# Altium project MB1189.PrjPCB (part 2 of 2)

## Sheet ST_LINK_V2-1.SCHDOC: ST-LINK/V2-1
size A4; Date: 9/24/2014; Author: P.A.; CompanyName: STMicroelectronics; Organization: Microcontrollers Division; Address1: 12, Rue Jules HOROWITZ; Address2: 38019 Grenoble; Address3: FRANCE; DocumentNumber: MB1189; Revision: B-07; SheetNumber: 12; SheetTotal: 12; Project: STM32F469I-DISCO
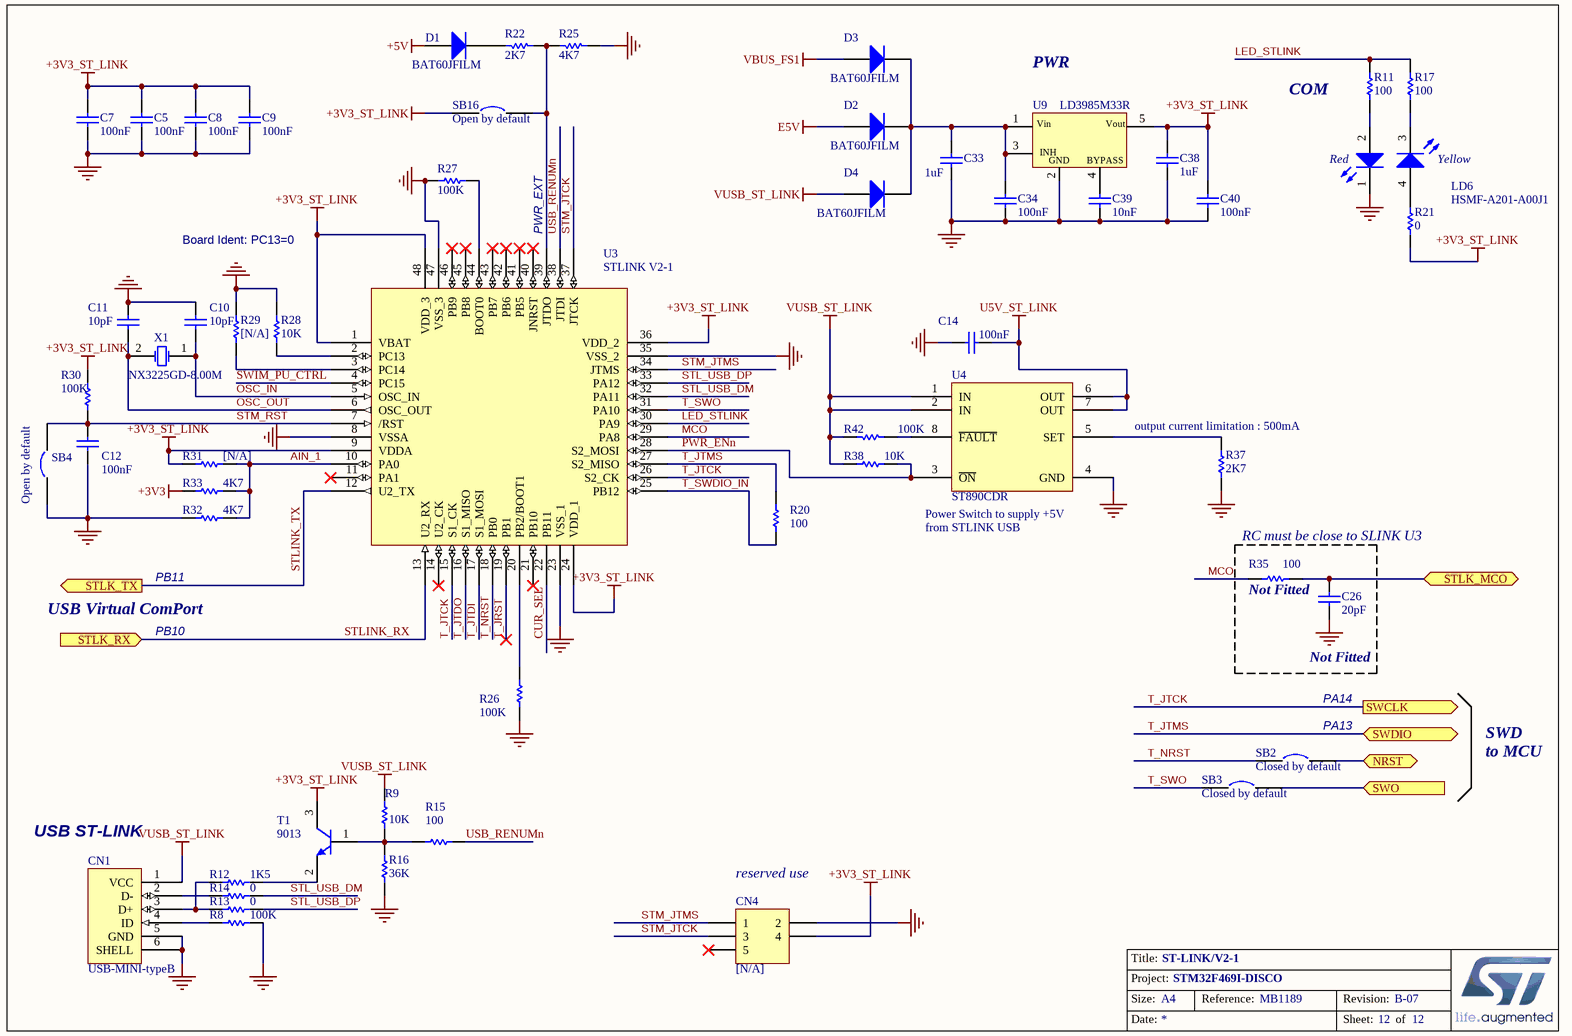
[diagram p10: ST_LINK_V2-1.SCHDOC]

### Parts
C5  100nF  [0402C]
C7  100nF  [0402C]
C8  100nF  [0402C]
C9  100nF  [0402C]
C10  10pF  [0603C]
C11  10pF  [0603C]
C12  100nF  [0402C]
C14  100nF  [0402C]
C26  20pF  [0603C]
C33  1uF  [0603C]
C34  100nF  [0402C]
C38  1uF  [0603C]
C39  10nF  [0603C]
C40  100nF  [0402C]
CN1  USB-MINI-typeB  [MINIUSB_AB_5SM_RA]
CN4  [N/A]  [HDR_2X3-1_2R54-6]
D1  BAT60JFILM  [SOD-323]
D2  BAT60JFILM  [SOD-323]
D3  BAT60JFILM  [SOD-323]
D4  BAT60JFILM  [SOD-323]
LD6  HSMF-A201-A00J1  [LED2_3528]
R8  100K  [0603R]
R9  10K  [0402R]
R11  100  [0603R]
R12  1K5  [0603R]
R13  0  [0603R]
R14  0  [0603R]
R15  100  [0603R]
R16  36K  [0603R]
R17  100  [0603R]
R20  100  [0603R]
R21  0  [0603R]
R22  2K7  [0603R]
R25  4K7  [0603R]
R26  100K  [0603R]
R27  100K  [0603R]
R28  10K  [0402R]
R29  [N/A]  [0603R]
R30  100K  [0603R]
R31  [N/A]  [0603R]
R32  4K7  [0603R]
R33  4K7  [0603R]
R35  100  [0603R]
R37  2K7  [0603R]
R38  10K  [0402R]
R42  100K  [0603R]
SB2  Closed by default  [SB_0603]
SB3  Closed by default  [SB_0603]
SB4  Open by default  [SB_0603]
SB16  Open by default  [SB_0603]
T1  9013  [SOT-23]
U3  STLINK V2-1  [LQFP48_0R5_9X9]
U4  ST890CDR  [SOIC8_1R27_4R9X6]
U9  LD3985M33R  [SOT23-5]
X1  NX3225GD-8.00M  [XTAL_2SM_3R2X2R5_H1]

### Ports
NRST (bidir), STLK_MCO, STLK_RX (in), STLK_TX (out), SWCLK (out), SWDIO, SWO (in)

### Nets
+3V3: R33.1
+3V3_ST_LINK: C5.2 C7.2 C8.2 C9.2 C38.1 C40.2 CN4.4 R21.2 R30.2 R31.1 SB16.1 T1.3(C) U3.1(VBAT) U3.9(VDDA) U3.24(VDD_1) U3.36(VDD_2) U3.48(VDD_3) U9.5(Vout)
+5V: D1.1(A)
E5V: D2.1(A)
GND: C5.1 C7.1 C8.1 C9.1 C10.2 C11.2 C12.1 C14.1 C26.2 C33.1 C34.1 C38.2 C39.1 C40.1 CN1.5(GND) CN1.6(SHELL) CN4.2 LD6.1(RED_cathode) R8.2 R16.1 R25.2 R26.1 R27.1 R28.1 R29.1 R32.1 R37.2 SB4.1 U3.8(VSSA) U3.23(VSS_1) U3.35(VSS_2) U3.47(VSS_3) U4.4(GND) U9.2(GND)
U5V_ST_LINK: C14.2 U4.6(OUT) U4.7(OUT)
VBUS_FS1: D3.1(A)
VUSB_ST_LINK: CN1.1(VCC) D4.1(A) R9.2 R38.1 R42.1 U4.1(IN) U4.2(IN)
AIN_1: R31.2 R32.2 R33.2 U3.10(PA0)
CUR_SEL: U3.22(PB11)
LED_STLINK: R11.1 R17.1 U3.30(PA9)
MCO: R35.1 U3.29(PA8)
NRST: SB2.2 ; port NRST
OSC_IN: C10.1 U3.5(OSC_IN) X1.1(OSC1)
OSC_OUT: C11.1 U3.6(OSC_OUT) X1.2(OSC2)
PWR_ENn: R38.2 U3.28(S2_MOSI) U4.3(~{ON})
STL_USB_DM: R14.2 U3.32(PA11)
STL_USB_DP: R13.2 U3.33(PA12)
STLINK_RX: U3.13(U2_RX) ; port STLK_RX  [project net PB10]
STLINK_TX: U3.12(U2_TX) ; port STLK_TX  [project net PB11]
STM_JTCK: CN4.3 U3.37(JTCK)
STM_JTMS: CN4.1 U3.34(JTMS)
STM_RST: C12.2 R30.1 SB4.2 U3.7(/RST)
SWIM_PU_CTRL: U3.4(PC15)
T_JRST: U3.19(PB1)
T_JTCK: U3.15(S1_CK) U3.26(S2_CK) ; port SWCLK  [project net PA14]
T_JTDI: U3.17(S1_MOSI)
T_JTDO: U3.16(S1_MISO)
T_JTMS: R20.2 U3.27(S2_MISO) ; port SWDIO  [project net PA13]
T_NRST: SB2.1 U3.18(PB0)
T_SWDIO_IN: R20.1 U3.25(PB12)
T_SWO: SB3.1 U3.31(PA10)
USB_RENUMn: R15.2 U3.38(JTDI)
NetC26_1: C26.1 R35.2 ; port STLK_MCO
NetC33_2: C33.2 C34.2 D2.2(K) D3.2(K) D4.2(K) U9.1(Vin) U9.3(CE)
NetC39_2: C39.2 U9.4(BYPASS)
NetCN1_2: CN1.2(D-) R14.1
NetCN1_3: CN1.3(D+) R12.1 R13.1
NetCN1_4: CN1.4(ID) R8.1
NetD1_2: D1.2(K) R22.1
NetLD6_2: LD6.2(Red_anode) R11.2
NetLD6_3: LD6.3(YellowGreen_cathode) R17.2
NetLD6_4: LD6.4(YellowGreen_anode) R21.1
NetR9_1: R9.1 R15.1 R16.2 T1.1(B)
NetR12_2: R12.2 T1.2(E)
NetR22_2: R22.2 R25.1 SB16.2 U3.39(JTDO)
NetR26_2: R26.2 U3.20(PB2/BOOT1)
NetR27_2: R27.2 U3.44(BOOT0)
NetR28_2: R28.2 U3.2(PC13)
NetR29_2: R29.2 U3.3(PC14)
NetR37_1: R37.1 U4.5(SET)
NetR42_2: R42.2 U4.8(~{FAULT})
NetSB3_2: SB3.2 ; port SWO

Not connected (* = marked no-connect by the designer): CN4 5*; U3 11(PA1)* 14(U2_CK)* 21(PB10)* 40(JNRST)* 41(PB5)* 42(PB6)* 43(PB7)* 45(PB8)* 46(PB9)*

### Notes on the sheet
- PWR
- COM
- Board Ident: PC13=0
- PWR_EXT
- (near R37) output current limitation : 500mA
- PB11
- (near U4) Power Switch to supply +5V from STLINK USB
- RC must be close to SLINK U3
- USB Virtual ComPort
- PB10
- Not Fitted
- (near C26) Not Fitted
- PA14
- (near SB2) PA13
- SWD
  to MCU
- (near CN1) USB ST-LINK
- (near CN4) reserved use
- Title:
- Project:
- Size:
- Date:
- A4
- Reference:
- Sheet:
- Revision:
- of
- (in symbol HSMF-A201-A00J1) Red; Yellow
- (in symbol LD3985M33R) INH

### Library data of the parts
C5 C7-C9 C12 C14 C34 C40 = Capacitor_ST: Capacitor 0402 / 0603 / 0805; Ordered by: Subcon; Revision: July-2002: Re-released for DXP Platform.; Value: 100nF
C10 C11 = Capacitor_ST: Capacitor 0402 / 0603 / 0805; Value: 100nF; Ordered by: Subcon; Revision: July-2002: Re-released for DXP Platform.
C26 = Cap_20pF_NPO_5%_0402: Capacitor,20pF,50V,NPO,5%,0402,YAGEO; Order: CC0402JRNPO9BN200; Fitted: NO; Ordered by: Subcon; Revision: July-2002: Re-released for DXP Platform.; Value: 20pF; Manuf_1: YAGEO; Manuf_Part_1: CC0402JRNPO9BN200
C33 C38 = CAP SMD 0603  X5R 1µF 25V 10%: Capacitor; Value: 1µF; Rated voltage: 25V; Tolerance: 10%; Ordered by: Subcon; Manufacturer: *; Manufacturer P/N: *; Order code Farnell: 1288202RL; Power: *; Technology: X5R; Temperature  Factor: *; Temperature Max: +125°C; Temperature Min: -55°C; STS Code: *
C39 = CAP SMD 0603  X7R 10000PF 50V 10%: 0603  X7R 10NF; Order code RS: 2040779; Rated voltage: 50V; Tolerance: 10%; Ordered by: Subcon; Order code Farnell: 7569548RL; Value: 10NF; Power: *; Technology: X7R; Temperature Factor: *; Temperature Min: -55°C; Temperature Max: +125°C; STS Code: *
CN1 = USB-MINI-typeB connector: Manuf_Part_1: 5075BMR-05-SM; Manuf_Part_2: 218205M1110T; Manuf_2: lyconn; Description: USB,MINI-USB-5P/F, 5075BMR-05-M; Ordered by: Subcon; Silkscreen: USB ST-LINK; Order: 5075BMR-05-SM
CN4 = Header 3X2: Header, 3-Pin, Dual row; Fitted: NO; Ordered by: Subcon; Revision: 17-Jul-2002: Re-released for DXP Platform.; Publisher: Altium Limited
D1-D4 = BAT60JFILM: Provided: ST; ECCN_US/EU: EAR99/NEC; Ref St: 9151097; Revision: July-2002: Re-released for DXP Platform.; Order: BAT60JFILM; Manuf_Part_1: BAT60JFILM; Manuf_1: ST; Distrib: ST; Ordered by: ST
LD6 = HSMF-A201-A00J1: Ordered by: Subcon; ECCN_US/EU: EAR99/NEC; Silkscreen: COM
R8 = res1: Resistor; Value: 1K; Ordered by: Subcon; Published: 8-Jun-2000; Revision: July-2002: Re-released for DXP Platform.; Publisher: Altium Limited
R9 R11 R16 R17 R21 R22 R25 R42 = Res1: Resistor; Value: 1K; Ordered by: Subcon; Published: 8-Jun-2000; Revision: July-2002: Re-released for DXP Platform.; Publisher: Altium Limited
R12-R14 R20 = Resistor_ST: Resistor; Description: Resistor 0402 or 0603 or 0805; Value: 10K; Ordered by: Subcon
R15 R26 R27 R30 R32 R33 R35 R37 = Resistor_ST: Resistor 0402 / 0603 / 0805; Description: Resistor 0402 or 0603 or 0805; Value: 10K; Ordered by: Subcon
R28 R38 = Resistor_ST: Resistor; Description: Resistor 0402 or 0603 or 0805; Ordered by: Subcon; Value: 10K
R29 R31 = Resistor_ST: Resistor 0402 / 0603 / 0805; Description: Resistor 0402 or 0603 or 0805; Value: 10K; Fitted: NO; Ordered by: Subcon
SB2 SB3 = Circuit Breaker: Ordered by: Subcon; Comments: Solder bridge; Published: 24-Mar-1999; Revision: July-2002: Re-released for DXP Platform.; Publisher: Altium Limited
SB4 SB16 = Circuit Breaker: Ordered by: Subcon; Comments: Solder bridge; Fitted: NO; Published: 24-Mar-1999; Revision: July-2002: Re-released for DXP Platform.; Publisher: Altium Limited
T1 = NPN: NPN Bipolar Transistor; Manuf_Part_1: MMBT9013; Code - JEDEC: TO-226-AA; Ordered by: Subcon; ECCN_US/EU: EAR99/NEC; Published: 8-Jun-2000; Revision: July-2002: Re-released for DXP Platform.; Publisher: Altium Limited
U3 = STM32F10x(48pin): Manuf_Part_1: STM32F103CBT6; Ordered by: ST; ECCN_US/EU: 3A991A2/NEC; Ref St: 9175111; Distrib: ST; Manuf_1: ST
U4 = ST890CDR: Ordered by: ST; Ref St: 9172002; ECCN_US/EU: EAR99/NEC; Manuf_1: ST; Manuf_Part_1: ST890CDR
U9 = LD3985M33R: Ultra low drop-low noise BiCMOS voltage, regulators low ESR capacitors compatible; Manuf_1: ST; Ref St: 9176161; ECCN_US/EU: EAR99/NEC; Manuf_Part_1: LD3985M33R; Provided: ST; Distrib: ST; Order: LD3985M33R; Ordered by: ST
X1 = XTAL_8M_NX3225GD: Crystal 8Mhz, 8pF, -+50PPM, SMD; Manuf_1: NDK; Manuf_Part_1: NX3225GD 8MHz EXS00A-CG04874; Manuf_Part_2: NX3225GD-8.000M-STD-CRA-3; ECCN_US/EU: EAR99/NEC; NDK Ref: X3127326; Ref St: 9157029; Provided: ST; Order: NX3225GD 8MHz EXS00A-CG04874; Ordered by: ST

## Nets that join several sheets
+1V8: Power (C32.1 U8.2 U8.4), AUDIO2 (7 pins)
+3V3: MCU (7 pins), ExtensionConnector (CN12.1), Power (C41.1 JP5.1 SB8.2 U8.3), Peripherals (15 pins), AUDIO2 (11 pins), DSI_LCD (9 pins), Memory (28 pins), QSPI (C62.1 R55.2 U12.8), USB_OTG_FS (R43.1 R153.2 R157.1 R158.2), Arduino_ Connectors (CN6.2 CN6.4), ST_LINK_V2-1 (R33.1)
+5V: Power (6 pins), DSI_LCD (L1.1 SB13.1), USB_OTG_FS (U16.5), Arduino_ Connectors (CN6.5), ST_LINK_V2-1 (D1.1)
E5V: Power (C35.1 JP2.1 U10.2 U10.4), ST_LINK_V2-1 (D2.1)
GND: MCU (57 pins), ExtensionConnector (CN12.2), Power (12 pins), Peripherals (7 pins), AUDIO2 (28 pins), DSI_LCD (12 pins), Memory (28 pins), QSPI (C62.2 U12.4), USB_OTG_FS (12 pins), Arduino_ Connectors (5 pins), ST_LINK_V2-1 (34 pins)
U5V_ST_LINK: Power (JP2.3), ST_LINK_V2-1 (C14.2 U4.6 U4.7)
VBUS_FS1: MCU (U14.E15), Power (JP2.5), USB_OTG_FS (5 pins), ST_LINK_V2-1 (D3.1)
VDD_MCU: MCU (40 pins), Power (JP5.2)
VIN: Power (C36.1 U10.3), Arduino_ Connectors (CN6.8)
VREF+: MCU (C78.2 C80.1 R123.2 U14.P1), Arduino_ Connectors (C13.2 R41.1)
A0: MCU (U14.D2), Memory (U11.G8)
A1: MCU (U14.E2), Memory (U11.G9)
A2: MCU (U14.G2), Memory (U11.F7)
A3: MCU (U14.H2), Memory (U11.F3)
A4: MCU (U14.J2), Memory (U11.G1)
A5: MCU (U14.K3), Memory (U11.G2)
A6: MCU (U14.M6), Memory (U11.G3)
A7: MCU (U14.N6), Memory (U11.H1)
A8: MCU (U14.P6), Memory (U11.H2)
A9: MCU (U14.M8), Memory (U11.J3)
A10: MCU (U14.N7), Memory (U11.G7)
A11: MCU (U14.M7), Memory (U11.H9)
A14: MCU (U14.N12), Memory (U11.J7)
A15: MCU (U14.N11), Memory (U11.H8)
AUDIO_RST: MCU (U14.A3), AUDIO2 (R48.2 U5.32)
D0: MCU (TP1.1 U14.L12), Memory (TP4.1 U11.R8)
D1: MCU (U14.K13), Memory (U11.N7)
D2: MCU (U14.B12), Memory (U11.R9)
D3: MCU (U14.C12), Memory (U11.N8)
D4: MCU (U14.R8), Memory (U11.P9)
D5: MCU (U14.N9), Memory (U11.M8)
D6: MCU (U14.P9), Memory (U11.M7)
D7: MCU (U14.R9), Memory (U11.L8)
D8: MCU (U14.P10), Memory (U11.L2)
D9: MCU (U14.R10), Memory (U11.M3)
D10: MCU (U14.R12), Memory (U11.M2)
D11: MCU (U14.P11), Memory (U11.P1)
D12: MCU (U14.R11), Memory (U11.N2)
D13: MCU (U14.L15), Memory (U11.R1)
D14: MCU (U14.L14), Memory (U11.N3)
D15: MCU (U14.K15), Memory (U11.R2)
D16: MCU (U14.P14), Memory (U11.E8)
D17: MCU (U14.N14), Memory (U11.D7)
D18: MCU (U14.P15), Memory (U11.D8)
D19: MCU (U14.N15), Memory (U11.B9)
D20: MCU (U14.M15), Memory (U11.C8)
D21: MCU (U14.E12), Memory (U11.A9)
D22: MCU (U14.E13), Memory (U11.C7)
D23: MCU (U14.D13), Memory (U11.A8)
D24: MCU (U14.E14), Memory (U11.A2)
D25: MCU (U14.D14), Memory (U11.C3)
D26: MCU (U14.C14), Memory (U11.A1)
D27: MCU (U14.C13), Memory (U11.C2)
D28: MCU (U14.D6), Memory (U11.B1)
D29: MCU (U14.D4), Memory (U11.D2)
D30: MCU (U14.E4), Memory (U11.D3)
D31: MCU (U14.D5), Memory (U11.E2)
HSSI_CLK_N: MCU (U14.H13), DSI_LCD (CN10.12)
HSSI_CLK_P: MCU (U14.H12), DSI_LCD (CN10.14)
HSSI_D0_N: MCU (U14.J13), DSI_LCD (CN10.8)
HSSI_D0_P: MCU (U14.J12), DSI_LCD (CN10.10)
HSSI_D1_N: MCU (U14.F13), DSI_LCD (CN10.16)
HSSI_D1_P: MCU (U14.F12), DSI_LCD (CN10.18)
I2C1_SCL: MCU (R140.2 U14.A7), Peripherals (CN11.3), DSI_LCD (CN2.3), Arduino_ Connectors (CN5.10 SB11.1)
I2C1_SDA: MCU (R142.2 U14.B4), Peripherals (CN11.1), DSI_LCD (CN2.4), Arduino_ Connectors (CN5.9 SB9.1)
I2C2_SCL: MCU (R121.2 U14.H4), AUDIO2 (U5.2)
I2C2_SDA: MCU (R124.2 U14.J3), AUDIO2 (U5.1)
LCD_BL_CTRL: MCU (U14.R2), DSI_LCD (R119.2)
LCD_INT: MCU (U14.M14), DSI_LCD (CN2.2 R36.2)
LCD_RST: MCU (U14.N13), DSI_LCD (CN2.5 CN10.5 R34.2)
NetC26_1: MCU (SB19.1), ST_LINK_V2-1 (C26.1 R35.2)
NetCN9_8: MCU (R135.2), Peripherals (CN9.8 R86.2)
NetCN12_15: ExtensionConnector (CN12.15), AUDIO2 (U5.6)
NetCN12_16: ExtensionConnector (CN12.16), AUDIO2 (U5.4)
NetR87_1: MCU (R87.1), AUDIO2 (U1.3 U2.3 U6.3)
NetSB3_2: MCU (SB7.1), ST_LINK_V2-1 (SB3.2)
NRST: MCU (U14.J1), ExtensionConnector (CN12.4), Peripherals (SB1.1), Arduino_ Connectors (CN6.3), ST_LINK_V2-1 (SB2.2)
PA0: MCU (U14.N3), Peripherals (R18.2)
PA1: MCU (U14.N2), Arduino_ Connectors (CN7.4)
PA2: MCU (U14.P2), Arduino_ Connectors (CN7.6)
PA4: MCU (U14.N4), Arduino_ Connectors (SB12.1)
PA5: MCU (U14.P4), ExtensionConnector (CN12.7)
PA6: MCU (U14.P3), Arduino_ Connectors (CN7.7)
PA7: MCU (U14.R3), Arduino_ Connectors (CN5.2)
PA8: MCU (U14.F15), ExtensionConnector (CN12.3)
PA10: MCU (U14.D15), USB_OTG_FS (R161.2)
PA13: MCU (U14.A15), ST_LINK_V2-1 (R20.2 U3.27)
PA14: MCU (U14.A14), ST_LINK_V2-1 (U3.15 U3.26)
PA15: MCU (U14.A13), ExtensionConnector (CN12.11)
PB0: MCU (U14.R5), Peripherals (CN11.4)
PB1: MCU (U14.R4), Arduino_ Connectors (CN8.1)
PB2: MCU (U14.M5), USB_OTG_FS (R151.2)
PB4: MCU (U14.A9), ExtensionConnector (CN12.5)
PB5: MCU (U14.A8), ExtensionConnector (CN12.9)
PB6: MCU (U14.B6), QSPI (R55.1 U12.1)
PB7: MCU (U14.B5), USB_OTG_FS (R156.1)
PB10: MCU (U14.P12), ST_LINK_V2-1 (U3.13)
PB11: MCU (U14.R13), ST_LINK_V2-1 (U3.12)
PB12: MCU (U14.L13), ExtensionConnector (CN12.12)
PB13: MCU (U14.K14), ExtensionConnector (CN12.10)
PB14: MCU (U14.R14), Arduino_ Connectors (CN5.5)
PB15: MCU (U14.R15), Arduino_ Connectors (CN5.4)
PC0: MCU (U14.M2), Memory (TP2.1 U11.K8)
PC1: MCU (U14.M3), ExtensionConnector (CN12.14)
PC2: MCU (U14.M4), Arduino_ Connectors (CN8.2)
PC3: MCU (U14.L4), Arduino_ Connectors (CN8.3)
PC4: MCU (U14.N5), Arduino_ Connectors (CN8.4)
PC5: MCU (U14.P5), Arduino_ Connectors (SB10.1)
PC6: MCU (U14.H15), ExtensionConnector (CN12.6)
PC7: MCU (U14.G15), ExtensionConnector (CN12.8)
PC8: MCU (U14.G14), Peripherals (CN9.7 R114.2)
PC10: MCU (U14.B14), Peripherals (CN9.1 R120.2)
PC11: MCU (U14.B13), Peripherals (CN9.2 R116.2)
PC12: MCU (U14.A12), Peripherals (CN9.5)
PC13: MCU (U14.D1), ExtensionConnector (CN12.13)
PD2: MCU (U14.D12), Peripherals (CN9.3 R115.2)
PD3: MCU (U14.C11), Arduino_ Connectors (CN5.6 SB5.2)
PD4: MCU (U14.D11), Peripherals (R3.1)
PD5: MCU (U14.C10), Peripherals (R4.1)
PD6: MCU (U14.B11), AUDIO2 (SB17.2 SB18.2 U2.4)
PE0: MCU (U14.A6), Memory (U11.K9)
PE1: MCU (U14.A5), Memory (U11.K1)
PE3: MCU (U14.A2), AUDIO2 (R46.2)
PE4: MCU (U14.A1), AUDIO2 (U5.40)
PE5: MCU (U14.B1), AUDIO2 (U5.38)
PE6: MCU (U14.B2), AUDIO2 (U5.39)
PF6: MCU (U14.K2), QSPI (U12.7)
PF7: MCU (U14.K1), QSPI (U12.3)
PF8: MCU (U14.L3), QSPI (TP6.1 U12.5)
PF9: MCU (U14.L2), QSPI (TP7.1 U12.2)
PF10: MCU (U14.L1), QSPI (TP5.1 U12.6)
PF11: MCU (U14.P8), Memory (U11.J9)
PG2: MCU (U14.M13), Peripherals (R57.1)
PG6: MCU (U14.J15), Peripherals (R2.1)
PG7: MCU (U14.J14), AUDIO2 (U5.37)
PG8: MCU (U14.H14), Memory (TP3.1 U11.J1)
PG9: MCU (U14.D9), Arduino_ Connectors (CN7.1)
PG10: MCU (U14.C8), Arduino_ Connectors (CN5.1)
PG11: MCU (U14.B8), Arduino_ Connectors (CN7.8)
PG12: MCU (U14.C7), Arduino_ Connectors (CN7.5)
PG13: MCU (U14.B3), Arduino_ Connectors (CN7.3)
PG14: MCU (U14.A4), Arduino_ Connectors (CN7.2)
PG15: MCU (U14.B7), Memory (U11.K7)
PH2: MCU (U14.K4), Memory (U11.J2)
PH3: MCU (U14.J4), Memory (U11.J8)
PH6: MCU (U14.P13), Arduino_ Connectors (CN5.3)
PI4: MCU (U14.C3), Memory (U11.F8)
PI5: MCU (U14.D3), Memory (U11.F2)
PJ2: MCU (U14.P7), DSI_LCD (CN10.22)
PK3: MCU (U14.D8), Peripherals (R5.1)
USB_FS1_N: MCU (U14.C15), USB_OTG_FS (D5.D3 R160.2)
USB_FS1_P: MCU (U14.B15), USB_OTG_FS (D5.C3 R159.2)